# EAGLE design Pong_final (EAGLE 7.5.0)
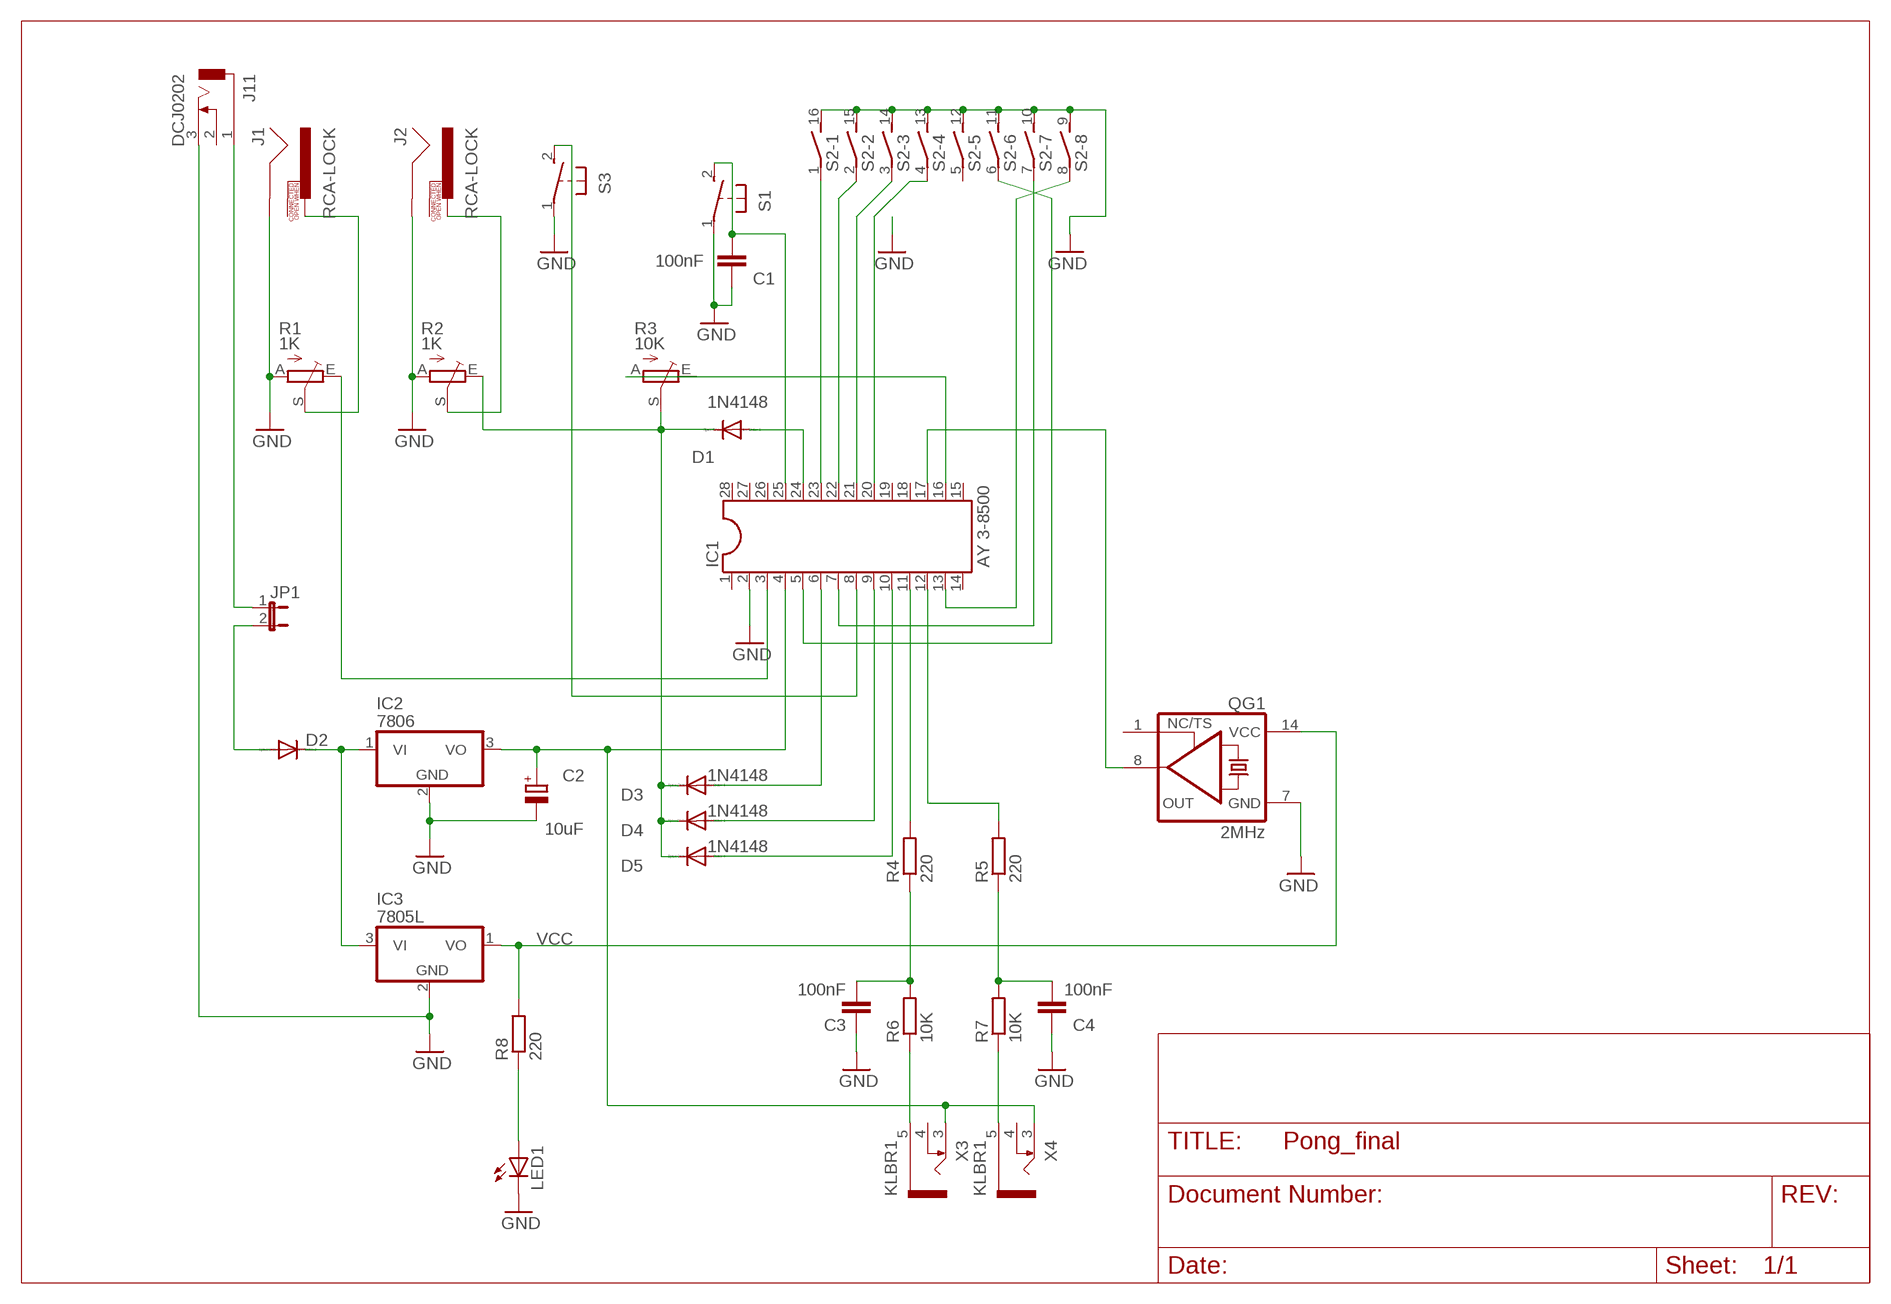
[diagram p0: schematic, sheet 1]

## Parts
C1  100nF  C-EUC0805  [C0805]
C2  10uF  CPOL-EUE2.5-6  [E2,5-6]
C3  100nF  C-EUC0805K  [C0805K]
C4  100nF  C-EUC0805K  [C0805K]
D1  1N4148  DIODE-MINIMELF  [MINIMELF]
D2  DIODE-MELF-MLL41  [MELF-MLL41]
D3  1N4148  DIODE-MINIMELF  [MINIMELF]
D4  1N4148  DIODE-MINIMELF  [MINIMELF]
D5  1N4148  DIODE-MINIMELF  [MINIMELF]
IC1  AY 3-8500  DIL28  [DIL28-6]
IC2  7806  7805TV  [TO220V]
IC3  7805L  [TO92]
J1  RCA-LOCK  [RCA_LOCK]
J2  RCA-LOCK  [RCA_LOCK]
J11  DCJ0202  [DCJ0202]
JP1  JP1E  [JP1]
LED1  LEDB155  [Q62902-B155]
QG1  2MHz  XO-14  [DIL14S]
R1  1K  TRIM_EU-CA6V  [CA6V]
R2  1K  TRIM_EU-CA6V  [CA6V]
R3  10K  TRIM_EU-CA6V  [CA6V]
R4  220  R-EU_R0805  [R0805]
R5  220  R-EU_R0805  [R0805]
R6  10K  R-EU_R0805  [R0805]
R7  10K  R-EU_R0805  [R0805]
R8  220  R-EU_R0805  [R0805]
S1  31-XX  [B3F-31XX]
S2  DIP08S  [DIP08S]
S3  31-XX  [B3F-31XX]
X3  KLBR1  [KLBR1]
X4  KLBR1  [KLBR1]

## Nets
GND: C1.1 C2.- C3.1 C4.1 IC1.2 IC2.2(GND) IC3.2(GND) J1.SHELL J2.SHELL J11.3 LED1.K(C) QG1.7(GND) R1.A R2.A S1.1(P) S2.9 S2.10 S2.11 S2.12 S2.13 S2.14 S2.15 S2.16 S3.1(P)
N$1: D2.C IC2.1(VI) IC3.3(VI)
N$2: D2.A JP1.2
N$3: LED1.A R8.1
N$4: J1.PIN R1.S
N$5: R6.1 X3.5
N$6: IC1.3 R1.E
N$7: J2.PIN R2.S
N$8: IC1.17 QG1.8(OUT)
N$9: IC1.5 S2.6
N$10: IC1.7 S2.7
N$11: IC1.13 S2.8
N$12: D3.A IC1.6
N$13: D4.A IC1.9
N$14: D5.A IC1.10
N$15: C2.+ IC1.4 IC2.3(VO) X3.3 X4.3
N$16: IC1.11 R4.2
N$17: IC1.12 R5.2
N$18: D1.A IC1.24
N$19: IC1.16 R3.A
N$20: IC1.8 S3.2(S)
N$21: IC1.23 S2.1
N$22: IC1.22 S2.2
N$23: IC1.21 S2.3
N$24: IC1.20 S2.4
N$25: J11.1 JP1.1
N$26: C1.2 IC1.25 S1.2(S)
N$28: D1.C D3.C D4.C D5.C R2.E R3.S
N$29: R7.1 X4.5
N$30: C3.2 R4.1 R6.2
N$31: C4.2 R5.1 R7.2
VCC: IC3.1(VO) QG1.14(VCC) R8.2
Unconnected: IC1.1 IC1.14 IC1.15 IC1.18 IC1.19 IC1.26 IC1.27 IC1.28 J1.SWITCH J2.SWITCH J11.2 QG1.1(TS) R3.E S2.5 X3.4 X4.4

## Library data of the parts
C1 C3 C4 = rcl:C-EU: CAPACITOR, European symbol
C2 = rcl:CPOL-EU: POLARIZED CAPACITOR, European symbol
D1-D5 = diode:DIODE-: DIODE
IC1 = ic-package:DIL28: Dual In Line
IC2 IC3 = linear:78*: Positive VOLTAGE REGULATOR Source: http://cache.national.com/ds/LM/LM78L05.pdf http://www.fairchildsemi.com/ds/LM/LM7805.pdf
J1 J2 = SparkFun-Connectors:RCA
J11 = con-jack-igi:DCJ0202: DC POWER JACK Source: DCJ0202.pdf; OC_FARNELL: unknown; OC_NEWARK: unknown
JP1 = jumper:JP1E: JUMPER
LED1 = led-igi:LED: LED OSRAM: - CHIPLED LG R971, LG N971, LY N971, LG Q971, LY Q971, LO R971, LY R971 LH N974, LH R974 LS Q976, LO Q976, LY Q976 LO Q996 - Hyper CHIPLED LW Q18S LB Q993, LB Q99A, LB R99A - SideLED LS A670, LO A670, LY A670, LG A670, LP A670 LB A673, LV A673, LT A673, LW A673 LH A674 LY A675 LS A676, LA A676, LO A676, LY A676, LW A676 LS A679, LY A679, LG A679 - Hyper Micro SIDELED® LS Y876, LA Y876, LO Y876, LY Y876 LT Y87S - SmartLED LW L88C, LW L88S LB L89C, LB L89S, LG L890 LS L89K, LO L89K, LY L89K LS L896, LA L896, LO L896, LY L896 - TOPLED LS T670, LO T670, LY T670, LG T670, LP T670 LSG T670, LSP T670, LSY T670, LOP T670, LYG T670 LG T671, LOG T671, LSG T671 LB T673, LV T673, LT T673, LW T673 LH T674 LS T676, LA T676, LO T676, LY T676, LB T676, LH T676, LSB T676, LW T676 LB T67C, LV T67C, LT T67C, LS T67K, LO T67K, LY T67K, LW E67C LS E67B, LA E67B, LO E67B, LY E67B, LB E67C, LV E67C, LT E67C LW T67C LS T679, LY T679, LG T679 LS T770, LO T770, LY T770, LG T770, LP T770 LB T773, LV T773, LT T773, LW T773 LH T774 LS E675, LA E675, LY E675, LS T675 LS T776, LA T776, LO T776, LY T776, LB T776 LHGB T686 LT T68C, LB T68C - Hyper Mini TOPLED® LB M676 - Mini TOPLED Santana® LG M470 LS M47K, LO M47K, LY M47K Source: http://www.osram.convergy.de LUXEON: - LUMILED® LXK2-PW12-R00, LXK2-PW12-S00, LXK2-PW14-U00, LXK2-PW14-V00 LXK2-PM12-R00, LXK2-PM12-S00, LXK2-PM14-U00 LXK2-PE12-Q00, LXK2-PE12-R00, LXK2-PE12-S00, LXK2-PE14-T00, LXK2-PE14-U00 LXK2-PB12-K00, LXK2-PB12-L00, LXK2-PB12-M00, LXK2-PB14-N00, LXK2-PB14-P00, LXK2-PB14-Q00 LXK2-PR12-L00, LXK2-PR12-M00, LXK2-PR14-Q00, LXK2-PR14-R00 LXK2-PD12-Q00, LXK2-PD12-R00, LXK2-PD12-S00 LXK2-PH12-R00, LXK2-PH12-S00 LXK2-PL12-P00, LXK2-PL12-Q00, LXK2-PL12-R00 Source: www.luxeon.com KINGBRIGHT: KA-3528ASYC Source: www.kingbright.com
QG1 = crystal:XO-: CRYSTAL; OC_FARNELL: unknown; OC_NEWARK: unknown
R1-R3 = pot:TRIM_EU-: POTENTIOMETER
R4-R8 = rcl:R-EU_: RESISTOR, European symbol
S1 S3 = switch-omron:31-XX: OMRON SWITCH; MPN: B3F-3100; OC_FARNELL: 959704; OC_NEWARK: 36M3582
S2 = switch-dil:DIP08S: DIL/CODE SWITCH; OC_FARNELL: unknown; OC_NEWARK: unknown
X3 X4 = con-igi:KLBR?: Jack connectors according to JISC 6560, 2.5mm / 3.5 mm Klinkensteckverbinder nach JISC 6560, 2.5mm / 3,5 mm Source: http://www.lumberg.com/Produkte/PDFs/KLBR2.pdf www.lumberg.com/Produkte/PDFs/KLBR1.pdf; MPN: KLBR 1; OC_FARNELL: 1200140; OC_NEWARK: 97K2707

## Board
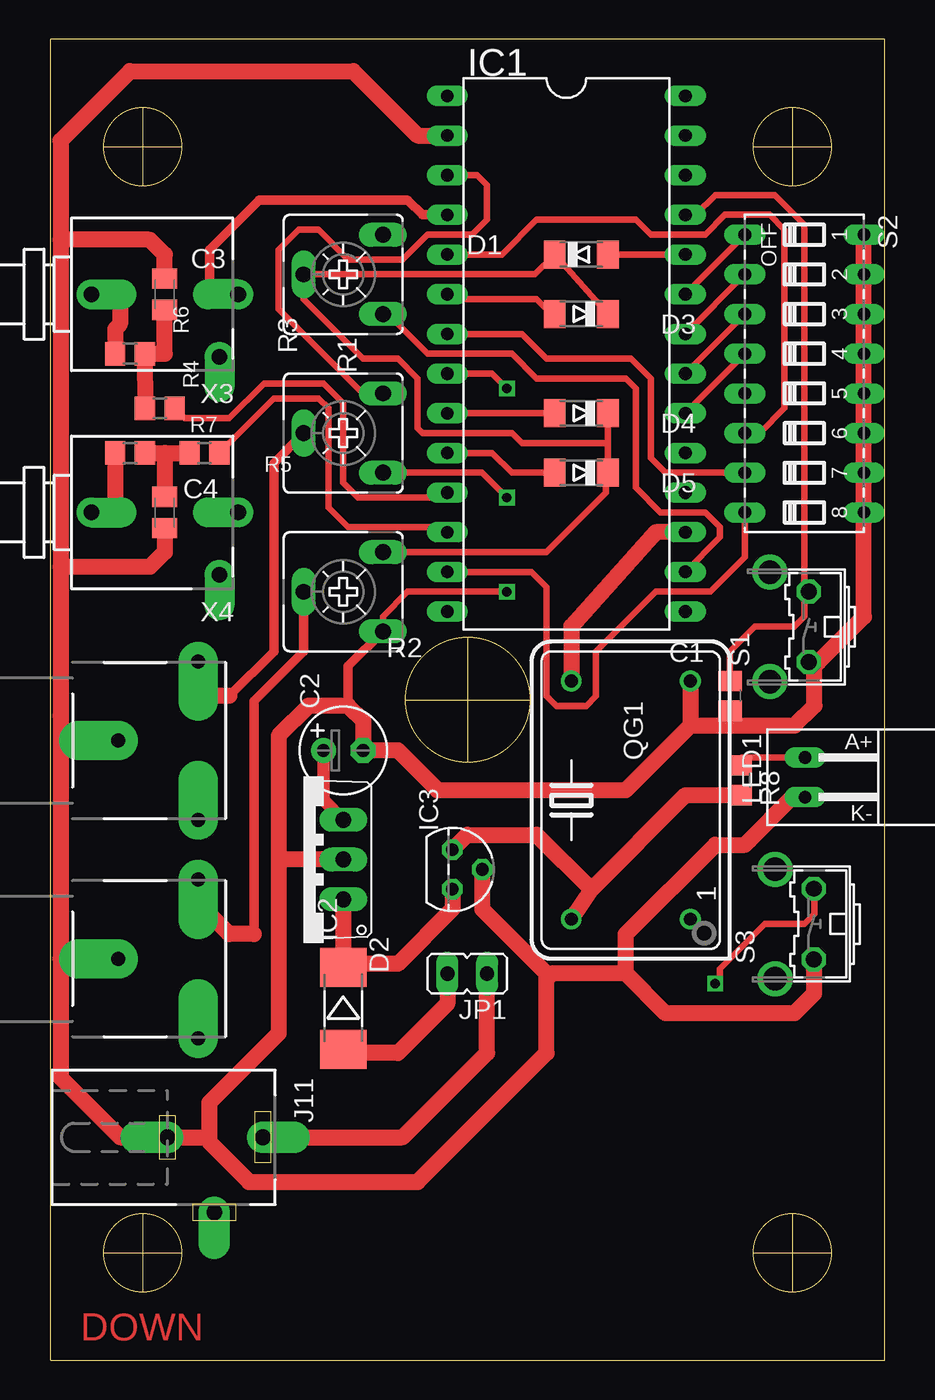
[diagram p1: board, top side]
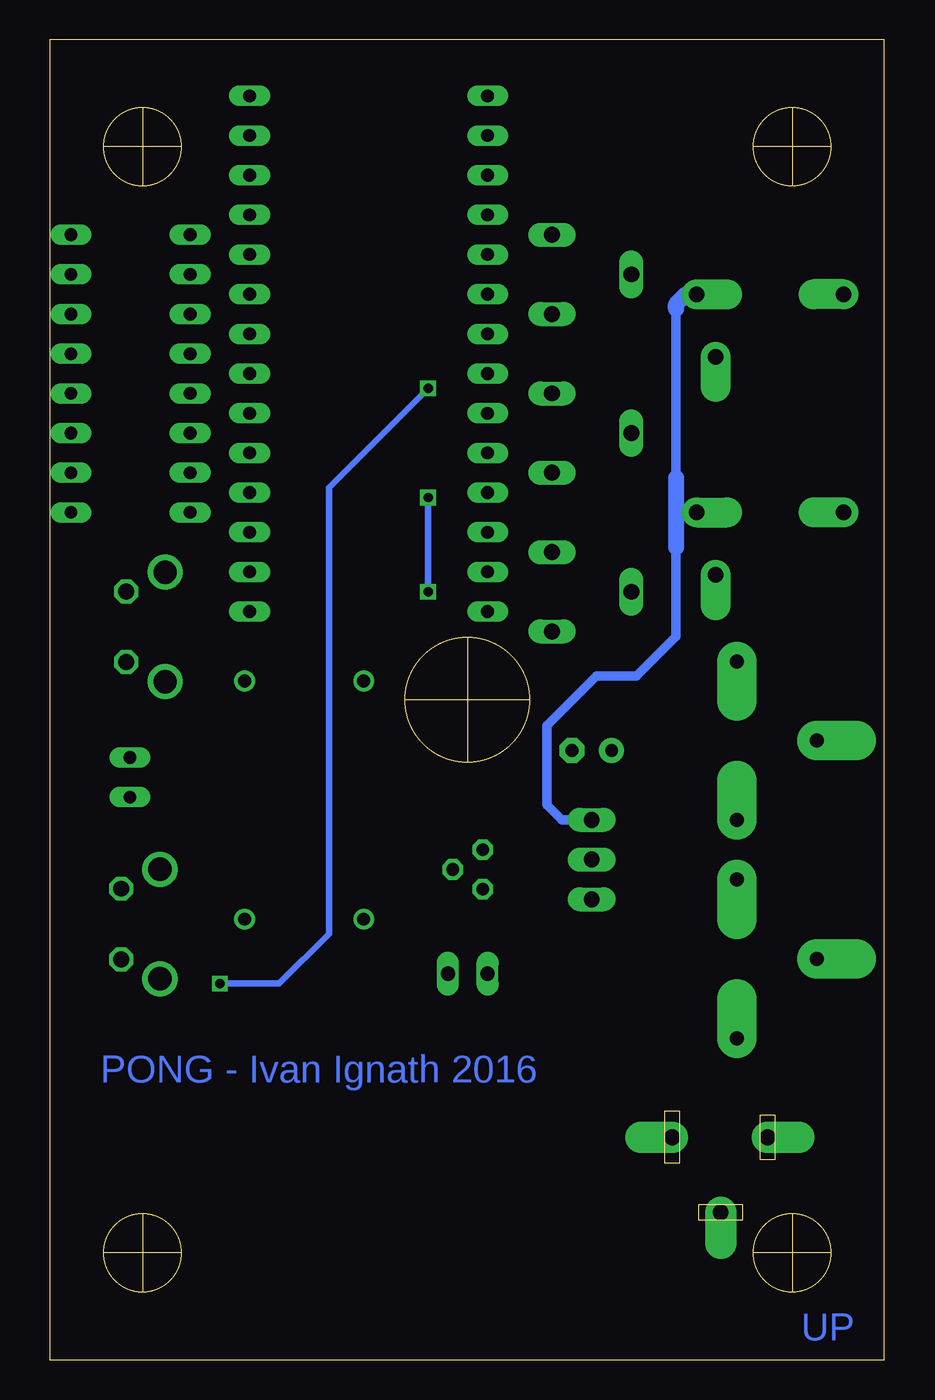
[diagram p2: board, bottom side, seen from below]

Size 53.4 x 84.6 mm. Coordinates in mm from the lower left corner, seen from the top.
Outline: 5.9,80.2 5.9,75.2
Outline: 3.4,77.7 8.4,77.7
Outline: 45,77.7 50,77.7
Outline: 47.5,80.2 47.5,75.2
Outline: 26.7,46.3 26.7,38.3
Outline: 22.7,42.3 30.7,42.3
Outline: 3.4,6.9 8.4,6.9
Outline: 5.9,9.4 5.9,4.4
Outline: 47.5,9.4 47.5,4.4
Outline: 45,6.9 50,6.9
Outline: 0,0 53.4,0 53.4,84.6 0,84.6 0,0
Outline: circle at 26.7,42.3 radius 4
Outline: circle at 5.9,6.9 radius 2.5
Outline: circle at 47.5,6.9 radius 2.5
Outline: circle at 5.9,77.7 radius 2.5
Outline: circle at 47.5,77.7 radius 2.5
Copper layers (1*16): DOWN 0.035mm / dielectric 1.5mm / UP 0.035mm
Design rules "default *": minimum track width 10mil, minimum drill 24mil, track to track 10mil, track to pad 10mil, pad to pad 10mil, via to via 10mil, smd to smd 8mil, copper to edge 40mil, drill to drill 8mil, minimum pad ring 10mil, minimum via ring 8mil, stop-mask expansion 4mil, vias tented up to drill 0mil, thermal gap 10mil

### Footprints (pad centres in the part's own frame; a part is rotated, then mirrored left to right if it is on the bottom)
C0805 = smd 1.3 x 1.5: 1 -0.95,0; 2 0.95,0
E2,5-6 = drill 0.813 pad 1.6: + -1.27,0 | drill 0.813 pad 1.6 octagon: - 1.27,0
C0805K = smd 1.3 x 1.6: 1 -1,0; 2 1,0
MINIMELF = smd 1.4 x 1.8: A 1.7,0; C -1.7,0
MELF-MLL41 = smd 2.5 x 3: A 2.625,0; C -2.625,0
DIL28-6 = drill 0.813 long: 1 -16.51,-7.62; 2 -13.97,-7.62; 3 -11.43,-7.62; 4 -8.89,-7.62; 5 -6.35,-7.62; 6 -3.81,-7.62; 7 -1.27,-7.62; 8 1.27,-7.62; 9 3.81,-7.62; 10 6.35,-7.62; 11 8.89,-7.62; 12 11.43,-7.62; 13 13.97,-7.62; 14 16.51,-7.62; 15 16.51,7.62; 16 13.97,7.62; 17 11.43,7.62; 18 8.89,7.62; 19 6.35,7.62; 20 3.81,7.62; 21 1.27,7.62; 22 -1.27,7.62; 23 -3.81,7.62; 24 -6.35,7.62; 25 -8.89,7.62; 26 -11.43,7.62; 27 -13.97,7.62; 28 -16.51,7.62
TO220V = drill 1.016 long: 1 -2.54,-2.54; 2 0,-2.54; 3 2.54,-2.54
TO92 = drill 0.813 octagon: 1 -1.27,0; 2 0,1.905; 3 1.27,0
RCA_LOCK = drill 0.9 pad 2.54 offset: PIN 4.03,5.072; SHELL -1.067,0; SWITCH 4.03,-5.097
DCJ0202 = drill 1 pad 2 offset: 1 0,3.1; 2 4.8,0; 3 0,-3
JP1 = drill 0.914 long: 1 0,-1.27; 2 0,1.27
Q62902-B155 = drill 0.813 long: A 7.62,-1.27; K 7.62,1.27
DIL14S = drill 0.813: 1 -7.62,-3.81; 7 7.62,-3.81; 8 7.62,3.81; 14 -7.62,3.81
CA6V = drill 1.016 long: A -2.54,-2.54; E 2.54,-2.54; S 0,2.54
R0805 = smd 1.3 x 1.5: 1 -0.95,0; 2 0.95,0
B3F-31XX = drill 1.016 octagon: 1 -2.261,-1.245; 2 2.261,-1.245 | drill 1.499 pad 2.159: 3 -3.505,1.245; 4 3.505,1.245
DIP08S = drill 0.813 long: 1 -8.89,-3.81; 2 -6.35,-3.81; 3 -3.81,-3.81; 4 -1.27,-3.81; 5 1.27,-3.81; 6 3.81,-3.81; 7 6.35,-3.81; 8 8.89,-3.81; 9 8.89,3.81; 10 6.35,3.81; 11 3.81,3.81; 12 1.27,3.81; 13 -1.27,3.81; 14 -3.81,3.81; 15 -6.35,3.81; 16 -8.89,3.81
KLBR1 = drill 1 pad 1.93 offset: 3 0,-4.7; 4 -4,-3.5; 5 0,4.7

### Placement (x,y rotation side)
C1  43.5,42.55 90 top
C2  18.73,39.05 0 top
C3  7.3,68.26 270 top
C4  7.3,54.29 90 top
D1  33.97,70.8 0 top
D2  18.73,22.54 270 top
D3  33.97,66.99 180 top
D4  33.97,60.64 180 top
D5  33.97,56.83 180 top
IC1  33.02,64.45 270 top
IC2  16.19,32.07 90 top
IC3  25.72,31.43 270 top
J1  5.4,39.69 0 top
J2  5.4,25.72 0 top
J11  10.48,14.29 270 top
JP1  26.67,24.77 90 top
LED1  55.93,37.33 180 top
QG1  37.15,35.88 90 top
R1  18.73,59.37 90 top
R2  18.73,49.21 90 top
R3  18.73,69.53 90 top
R4  6.99,60.96 0 top
R5  9.84,58.1 0 top
R6  5.08,64.45 0 top
R7  5.08,58.1 0 top
R8  44.13,37.15 270 top
S1  47.29,46.97 90 top
S2  48.26,63.18 270 top
S3  47.62,27.94 90 top
X3  7.3,68.26 90 top
X4  7.3,54.29 90 top

### Tracks (layer width: path | path; a pad name or v marks a point on that pad's centre or on a via)
GND  (via drill 0.6)
  DOWN 0.406: 20.32,38.73 C2.- | R1.A 27.62,56.83 v29.21,55.24 | R2.A 21.27,47.62 22.86,49.21 v29.21,49.21 | 48.9,25.65 S3.1 | C1.1 43.18,41.59 43.18,40.64
  DOWN 0.61: 20.32,39.37 C2.- | 19.05,41.91 19.05,44.45 R2.A | 0.95,39.69 0.64,41.27
  DOWN 1.016: IC1.2 23.5,78.42 19.37,82.55 5.08,82.55 0.64,78.11 0.64,71.75 | 0.64,71.75 0.64,50.8 | 0.64,50.8 0.64,41.27 0.64,25.72 | 14.61,32.07 14.61,40.01 16.51,41.91 19.05,41.91 20,40.96 C2.- 22.23,39.05 24.77,36.51 36.83,36.51 40.96,40.64 | QG1.7 40.96,40.64 | 40.96,40.64 43.18,40.64 47.62,40.64 48.9,41.91 48.9,44.35 S1.1 49.15,44.71 52.07,47.62 S2.9 S2.10 S2.11 S2.12 S2.13 S2.14 S2.15 S2.16 | 36.83,24.77 36.83,27.3 42.55,33.02 44.45,33.02 47.62,36.2 48.17,36.2 LED1.K | S3.1 48.87,23.47 47.62,22.23 39.37,22.23 36.83,24.77 | J1.SHELL 0.95,39.69 | 36.83,24.77 32.07,24.77 31.91,24.61 31.75,24.77 | IC3.2 27.62,28.89 31.75,24.77 | IC2.2 14.61,32.07 | C4.1 7.3,51.75 6.35,50.8 0.64,50.8 | C3.1 7.3,70.8 6.35,71.75 0.64,71.75 | 14.61,32.07 14.61,20.95 10.16,16.51 10.16,14.29 | J2.SHELL 0.64,25.72 | 0.64,25.72 0.64,18.1 4.45,14.29 J11.3 10.16,14.29 | 10.16,14.29 10.16,13.97 12.7,11.43 23.5,11.43 31.75,19.68 31.75,24.77
  UP 0.406: v29.21,55.24 v29.21,49.21
N$1
  DOWN 1.016: IC2.1 D2.C 18.96,25.4 22.23,25.4 25.72,28.89 IC3.3
N$2
  DOWN 1.016: JP1.2 25.4,22.86 22.23,19.68 18.96,19.68 D2.A
N$3
  DOWN 0.406: LED1.A 44.26,38.6 R8.1
N$4
  DOWN 0.61: R1.S 14.29,57.47 14.29,45.4 11.43,42.55
  DOWN 1.016: 11.43,42.55 9.53,42.55 9.53,44.66 J1.PIN
N$5
  DOWN 1.016: X3.5 4.45,68.26 4.45,66.36 4.13,66.04 R6.1
N$6
  DOWN 0.406: R1.E 20,61.91 14.61,67.31 14.61,71.12 15.88,72.39 17.14,72.39 19.05,70.48 22.54,70.48 24.13,72.07 26.99,72.07 27.94,73.03 27.94,75.25 27.3,75.88 IC1.3
N$7
  DOWN 0.61: R2.S 16.19,45.4 13.02,42.23 13.02,27.3
  DOWN 1.016: 13.02,27.3 11.43,27.3 9.53,29.21 9.53,30.69 J2.PIN
N$8
  DOWN 0.406: 40.01,53.02 IC1.17
  DOWN 1.016: 40.01,53.02 38.73,53.02 33.34,46.99 QG1.8
N$9
  DOWN 0.406: IC1.5 28.89,70.8 31.11,73.03 37.47,73.03 38.42,72.07 41.91,72.07 43.18,73.34 46.04,73.34 46.99,72.39 46.99,60.96 45.4,59.37 S2.6
N$10
  DOWN 0.406: S2.7 39.37,56.83 38.42,57.78 38.42,62.87 37.15,64.14 31.75,64.14 30.16,65.72 IC1.7
N$11
  DOWN 0.406: S2.8 44.45,51.44 42.23,49.21 38.73,49.21 34.92,45.4 34.92,42.55 34.29,41.91 32.38,41.91 31.75,42.55 31.75,49.53 30.8,50.48 IC1.13
N$12
  DOWN 0.406: IC1.6 26.67,67.94 31.11,67.94 32.07,66.99 D3.A
N$13
  DOWN 0.406: D4.A IC1.9
N$14
  DOWN 0.406: IC1.10 28.26,58.1 29.53,56.83 D5.A
N$15
  DOWN 0.61: IC1.4 23.81,73.34 22.86,74.3 13.34,74.3 10.16,71.12 10.16,68.26 X3.3
  DOWN 0.813: C2.+ 17.46,35.88 IC2.3
  UP 0.61: X3.3 10.16,68.26 | IC2.3 20.64,34.61 21.59,35.56 21.59,40.64 18.41,43.81 15.88,43.81 13.34,46.35 13.34,52.07 | 13.34,67.31 13.34,56.52
  UP 1.016: 13.34,67.31 13.34,67.63 12.7,68.26 X3.3 | 13.34,56.52 13.34,53.98 | 13.34,53.98 13.34,52.07 | X4.3 13.02,54.29 arc-90 13.34,53.98
N$16
  DOWN 0.406: IC1.11 25.08,55.24 19.68,55.24 18.73,56.2 18.73,61.28 17.46,62.55 13.65,62.55 11.43,60.33 8.57,60.33 R4.2
N$17
  DOWN 0.406: 11.11,58.1 R5.2 14.29,61.59 17.14,61.59 17.78,60.96 17.78,54.61 19.05,53.34 25.08,53.34 IC1.12
N$18
  DOWN 0.406: D1.A IC1.24
N$19
  DOWN 0.406: R3.A 21.59,66.99 24.13,64.45 29.53,64.45 31.11,62.87 36.83,62.87 37.47,62.23 37.47,55.88 39.05,54.29 41.91,54.29 42.86,53.34 42.86,52.7 IC1.16 41.59,50.8
N$20  (via drill 0.6)
  DOWN 0.406: IC1.8 28.26,63.18 v29.21,62.23 | v42.55,24.13 42.8,24.13 42.86,25.08 45.72,27.94 48.26,27.94 48.9,28.57 48.9,30.2 S3.2
  UP 0.406: v29.21,62.23 35.56,55.88 35.56,27.3 38.73,24.13 v42.55,24.13
N$21
  DOWN 0.406: IC1.23 S2.1
N$22
  DOWN 0.406: IC1.22 S2.2
N$23
  DOWN 0.406: IC1.21 S2.3
N$24
  DOWN 0.406: IC1.20 S2.4
N$25
  DOWN 1.016: J11.1 22.54,14.29 27.94,19.68 JP1.1
N$26
  DOWN 0.406: IC1.25 41.27,73.34 42.55,74.61 46.35,74.61 48.26,72.71 48.26,49.51 S1.2 48.26,48.95 48.26,47.62 47.62,46.99 45.09,46.99 43.5,45.4 C1.2
N$28
  DOWN 0.406: D3.C D1.C 31,69.53 R3.S 16.19,67.94 20,64.14 22.23,64.14 23.5,62.87 23.5,59.69 23.81,59.37 29.53,59.37 30.16,58.74 35.67,58.74 | 35.67,58.74 D5.C 35.56,56.72 35.56,55.56 31.75,51.75 R2.E | 35.67,58.74 D4.C
N$29
  DOWN 1.016: R7.1 4.13,54.29 X4.5
N$30
  DOWN 1.016: C3.2 7.3,64.45 R6.2 R4.1
N$31
  DOWN 1.016: R7.2 7.3,58.1 | 7.3,58.1 R5.1 | 7.3,58.1 C4.2
VCC
  DOWN 1.016: 34.61,30.16 40.64,36.2 R8.2 | 34.61,30.16 QG1.14 | IC3.1 26.67,33.66 31.11,33.66 34.61,30.16

### Text on the board
DOWN: DOWN
UP: PONG - Ivan Ignath 2016 | UP